# Altium schematic sheet [18]-WIFI_MODULE.SchDoc
size A4
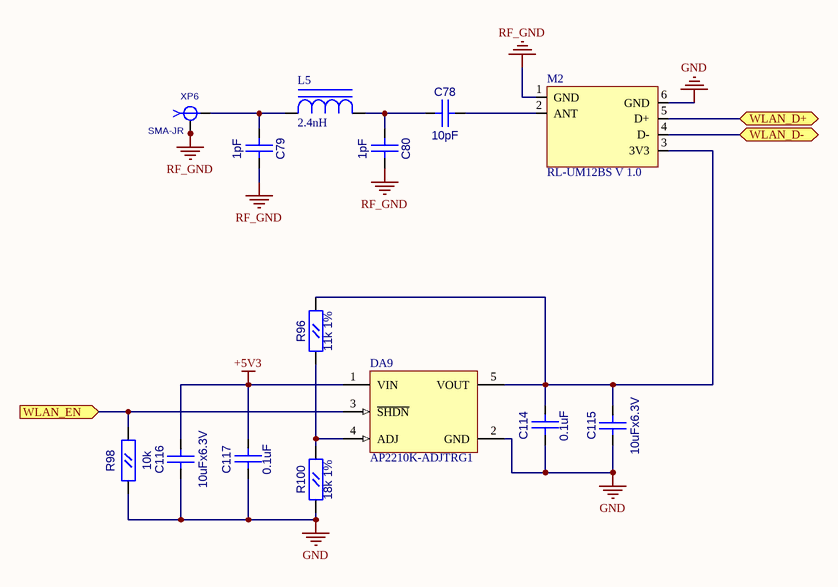
[diagram p0: [18]-WIFI_MODULE.SchDoc]

## Parts
C78  10pF  [CC0603]
C79  1pF  [CC0603]
C80  1pF  [CC0603]
C114  0.1uF  [CC0603]
C115  10uFx6.3V  [CC0805]
C116  10uFx6.3V  [CC0805]
C117  0.1uF  [CC0603]
DA9  AP2210K-ADJTRG1  [SOT23-5]
L5  2.4nH  [L0402]
M2  RL-UM12BS V 1.0  [RTL8188_MODULE]
R96  11k 1%  [RC0603]
R98  10k  [RC0603]
R100  18k 1%  [RC0603]
XP6  SMA-JR  [SMA-JR]

## Ports
WLAN_D+ (bidir), WLAN_D- (bidir), WLAN_EN (in)

## Nets
+5V3: C116.2(B) C117.1(A) DA9.1(VIN)
GND: C114.2(B) C115.1(A) C116.1(A) C117.2(B) DA9.2(GND) M2.6(GND) R98.1(A) R100.1(A)
RF_GND: C79.2(B) C80.2(B) M2.1(GND) XP6.2 XP6.3 XP6.4 XP6.5
WLAN_D+: M2.5(D+) ; port WLAN_D+
WLAN_D-: M2.4(D-) ; port WLAN_D-
WLAN_EN: DA9.3(~{SHDN}) R98.2(B) ; port WLAN_EN
NetC78_1: C78.1(A) C80.1(A) L5.2(C)
NetC78_2: C78.2(B) M2.2(ANT)
NetC79_1: C79.1(A) L5.1(A) XP6.1
NetC114_1: C114.1(A) C115.2(B) DA9.5(VOUT) M2.3(3V3) R96.2(B)
NetDA9_4: DA9.4(ADJ) R96.1(A) R100.2(B)

## Library data of the parts
C78-C80 C114 C117 = CC0603
  C78: Value: 10pF
  C79 C80: Value: 1pF
  C114 C117: Value: 0.1uF
C115 C116 = CC0805: Value: 10uFx6.3V
DA9 = MCP1824T-ADJE/OT: 300 mA, Low Voltage, Low Quiescent Current LDO Regulator, 5-Pin SOT-223, Extended Temperature, Tape and Reel; Published: 29-Jan-2009; DatasheetVersion: revA, Aug-2007; PackageVersion: revAW, Oct-2008; PackageReference: SOT-223-DC5; Publisher: Altium Limited; PackageDescription: 5-Lead Plastic Small Outline Transistor (DC) [SOT-223]; ComponentLink1Description: Manufacturer Link; ComponentLink1URL: http://www.microchip.com; ComponentLink2Description: Datasheet; ComponentLink2URL: http://ww1.microchip.com/downloads/en/DeviceDoc/22070a.pdf; ComponentLink3Description: Packaging Specification; ComponentLink3URL: http://ww1.microchip.com/downloads/en/PackagingSpec/00049AW.pdf
L5 = L0402: Value: 2.4nH
M2 = RTL8188_MODULE: Value: RL-UM12BS V 1.0
R96 R98 R100 = RC0603
  R96: Value: 11k 1%
  R98: Value: 10k
  R100: Value: 18k 1%
XP6 = SMA-JR: Value: SMA-JR